# EasyEDA Pro project NU1680无线充电接收端底座.eprj, board 磁吸
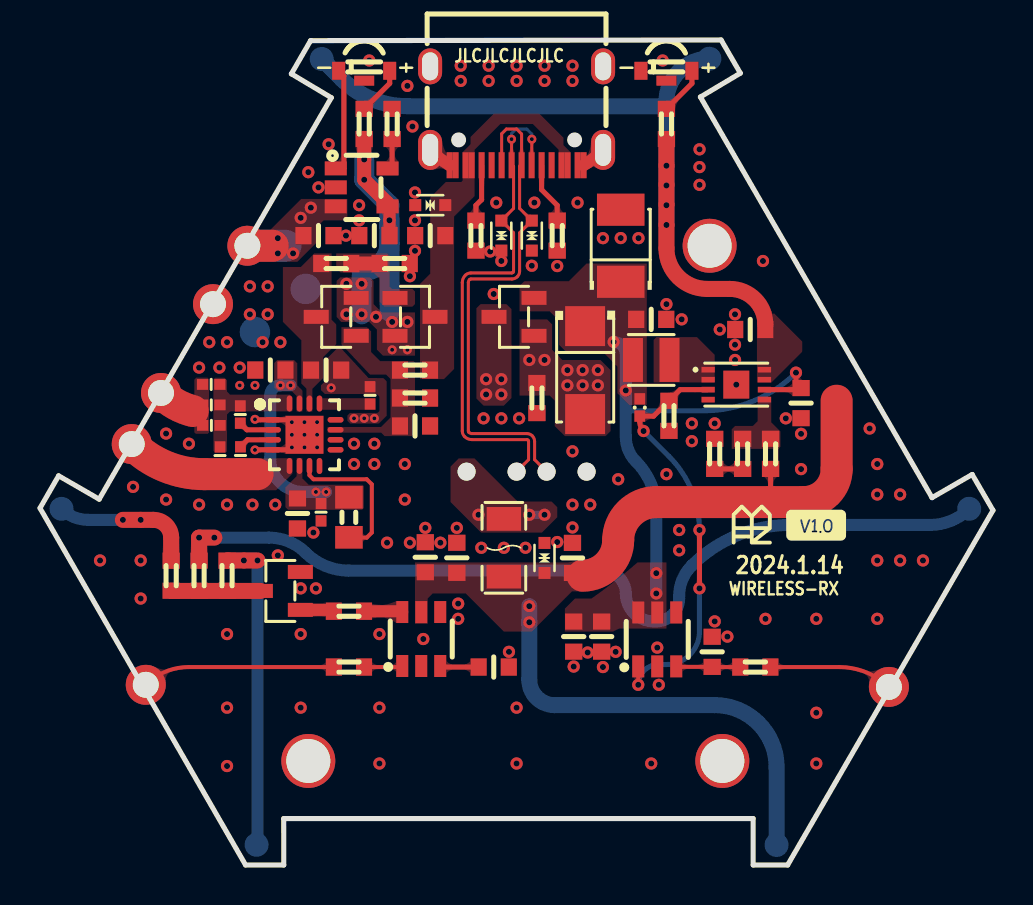
[diagram p2: board, top side]
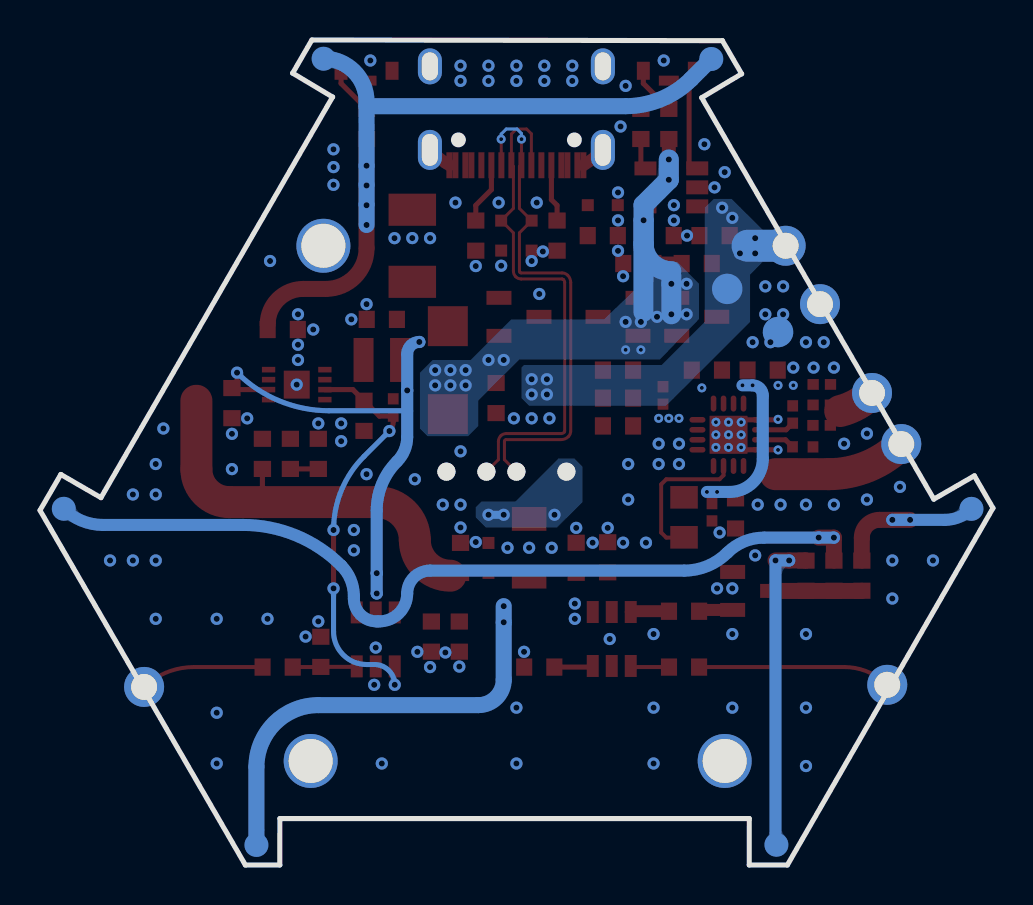
[diagram p3: board, bottom side, seen from below]

Outline 47.65 x 41.29 mm; copper layers: Top Layer, Bottom Layer. Coordinates in mm from the lower left corner of the outline.
Outline path: 0,17.86 10.28,0 12.19,0 12.19,2.33 35.66,2.33 35.66,0 37.38,0 47.65,17.75 46.61,19.54 44.6,18.38 33.02,38.43 35.02,39.63 34.06,41.29 13.53,41.25 12.57,39.59 14.57,38.4 2.96,18.31 0.93,19.48 0,17.86
Stack: Top Layer 0.035mm / Dielectric1 1.51mm FR4 er 4.5 / Bottom Layer 0.035mm

## Design rules (mm)
net USB_DV_D+: DP1
net USB_DV_D-: DP1
template: 自定义配置1
spacing copperThickness1oz (default): track to track 0.102, other pairs 0.152 to 0.3
spacing copperThickness2oz: track to track 0.203, other pairs 0.152 to 0.3
spacing safeClearance: track to track 0.089, other pairs 0.089 to 0.3
spacing Default: track to track 0.099, other pairs 0 to 0.099
track width copperThickness1oz (default): min 0.127, default 0.254, max 2.54
track width copperThickness2oz: min 0.203, default 0.254, max 2.54
track width Default: min 0.14, default 0.14, max 25.4
differential pair differentialPair (default): width min 0.127, default 0.254, max 2.54; gap min 0.152, default 0.152
via viaSize (default): diameter min 0.439, default 0.439, max 100.025; hole min 0.191, default 0.191, max 59.995
via Default: diameter min 0.439, default 0.439, max 100.025; hole min 0.191, default 0.191, max 59.995
region e3966 uses copperRegion1
region e3967 uses copperRegion1
region e7122 uses copperRegion1
region e7123 uses copperRegion1
pour e3968 uses copperRegion

## Placement (name value [footprint] x y rotation side)
C1  47nF/0402/50V  [C0402]  10.02 20.5 270 top
C2  47nF/0402/50V  [C0402]  10.02 22.54 270 top
C3  1uF/0402  [C0402]  16.5 23.5 270 top
C7  100nF/0402/50V  [C0402]  8.57 22 180 top
C8  47nF/0402/50V  [C0402]  8.56 23.03 180 top
C9  33nF/0402/50V  [C0402]  8.56 24.05 180 top
C10  10uF/0603  [C0603]  11.52 24.77 0 top
C11  10uF/0603  [C0603]  12.87 17.59 90 top
C12  100nF/0402/50V  [C0402]  14.05 17.65 270 top
C21  2.2nF/0402/50V  [C0402]  9 20.49 270 top
C22  100nF/0603  [C0603]  18.75 21.97 180 top
C23  4.7uF/0603  [C0603]  16.72 31.5 0 top
C24  10uF/0603  [C0603]  13.92 31.5 180 top
C27  100uF  [CAP-SMD_L3.5-W2.8]  29.04 30.99 270 top
C28  22uF/0603  [C0603]  30.56 27.31 0 top
C29  22uF/0603  [C0603]  35.51 26.8 180 top
C30  1uF/0603  [C0603]  38.05 23.12 90 top
C32  10uF/0603  [C0603]  26.62 15.37 90 top
C33  10uF/0603  [C0603]  20.84 15.37 90 top
C34  10nF/0603  [C0603]  22.69 9.91 0 top
C35  100nF/0603  [C0603]  19.27 15.4 90 top
C36  10uF/0603  [C0603]  14.3 24.77 0 top
C37  10pF/0603  [C0603]  33.61 10.67 90 top
C38  10uF/0603  [C0603]  19.51 31.5 180 top
C39  10uF/0603  [C0603]  28.08 11.43 270 top
C40  100nF/0603  [C0603]  26.69 11.43 270 top
D3  SS34_C3032484  [SMA_L4.3-W2.6-LS5.2-RD]  27.26 24.77 270 top
D9  LESD5D5.0CT1G  [SOD-523_L1.2-W0.8-LS1.6-BI]  24.59 31.5 90 top
D10  LESD5D5.0CT1G  [SOD-523_L1.2-W0.8-LS1.6-BI]  23.07 31.5 90 top
D11  LESD5D5.0CT1G  [SOD-523_L1.2-W0.8-LS1.6-BI]  19.51 33.02 0 top
D12  LESD5D5.0CT1G  [SOD-523_L1.2-W0.8-LS1.6-BI]  25.23 15.37 270 top
H1  2.54-1*1P针  [2mm-1.3mm孔]  6.05 23.62 90 top
H2  2.54-1*1P针  [2mm-1.3mm孔]  4.59 21.07 0 top
H3  2.54-1*1P针  [2mm-1.3mm孔]  5.29 9.02 180 top
H6  2.54-1*1P针  [2mm-1.3mm孔]  42.45 8.91 90 top
H7  2.54-1*1P针  [2mm-1.3mm孔]  10.37 30.99 0 top
H8  2.54-1*1P针  [2mm-1.3mm孔]  8.65 28.07 0 top
L4  1.5uH  [IND-SMD_L2.5-W2.0_MHCD252012A]  30.56 25.27 180 top
LED1  CHARGE  [LED-SMD_L3.2-W1.0-R-RD]  16.21 39.5 0 top
LED2  OUT  [LED-SMD_L3.2-W1.0-R-RD]  31.32 39.5 0 top
NOREF  -  [Pad_e233]  13.42 5.21 0 top
NOREF#2  -  [Pad_e234]  34.12 5.21 0 top
NOREF#3  -  [Pad_e119]  33.48 30.99 0 top
NOREF#4  -  [Pad_e393]  10.75 26.67 0 top
NOREF#5  -  [Pad_e391]  13.29 28.83 0 top
Q2  DMG2305UX-7  [SOT-23-3_L2.9-W1.3-P1.90-LS2.4-BR]  18.75 27.43 180 top
Q3  DMG2305UX-7  [SOT-23-3_L2.9-W1.3-P1.90-LS2.4-BR]  14.81 27.43 0 top
Q8  DMG2305UX-7  [SOT-23-3_L2.9-W1.3-P1.90-LS2.4-BR]  23.7 27.43 0 top
Q10  S8050  [SOT-23-3_L2.9-W1.3-P1.90-LS2.4-BR]  12.02 13.72 0 top
R1  220R/0805  [R0805]  15.45 17.4 90 top
R2  5.1k  [R0603]  18.75 24.77 0 top
R3  100k  [R0603]  18.75 23.37 0 top
R4  5.1k  [R0603]  14.81 30.1 180 top
R5  100k  [R0603]  17.73 30.1 0 top
R7  1k  [R0603]  16.21 37.09 90 top
R27  1M  [R0603]  36.53 20.58 270 top
R28  15.8k  [R0603]  35.13 20.58 90 top
R29  300k  [R0603]  33.74 20.58 270 top
R33  5.1k  [R0603]  21.8 31.5 270 top
R34  5.1k  [R0603]  25.86 31.5 270 top
R35  5.1k  [R0603]  15.45 9.91 0 top
R38  2k  [R0603]  15.45 12.7 180 top
R44  1k  [R0603]  35.77 9.91 0 top
R48  1M  [R0603]  24.85 23.37 270 top
R49  2k  [R0603]  17.61 37.09 270 top
R51  0R/NC  [R0402]  29.99 22.9 270 top
R52  2k  [R0603]  31.32 37.09 270 top
R53  1M  [R0603]  31.45 22.48 90 top
R54  20R  [R0603]  6.56 14.48 90 top
R55  20R  [R0603]  7.95 14.48 90 top
R56  20R  [R0603]  9.35 14.48 90 top
U1  NU1680  [QFN-16_L3.0-W3.0-P0.50-TL-EP1.9]  13.21 21.53 0 top
U4  TP4054  [TSOT-23-5_L2.9-W1.6-P0.95-LS2.8-BR]  16.08 33.91 180 top
U5  SY7088DGC  [DFN-8_L3.0-W2.0-P0.50-BL-EP]  34.82 24.04 270 top
U6  6021WS  [SOT-23-6_L2.9-W1.6-P0.95-LS2.8-BR]  19.06 11.31 270 top
U8  -  [3V 24MM LED S]  39.96 29.08 210 bottom
U9  -  [3V 24MM LED S]  23.83 1.02 90 bottom
U10  -  [3V 24MM LED S]  7.57 29.08 150 bottom
U14  RH6015C  [SOT-23-6_L2.9-W1.6-P0.95-LS2.8-BR]  30.86 11.29 270 top
U15  TLC-NSMD100  [F1206]  23.2 15.88 270 top
U16  -  [螺旋磁吸充电公座4P]  23.83 19.69 0 bottom
USB2  TYPE-C-31-M-12  [USB-C_SMD-TYPE-C-31-M-12]  23.83 37.49 180 top

## Footprints (pads in the part's own frame, mm; a bottom-side part is the same pattern mirrored in y, then rotated)
2mm-1.3mm孔
  round 2 hole 1.3x1.1: 1(0,0)
3V 24MM LED S
  round 1.2 smd: 1(-0.013,13) 2(-0.003,-13)
C0402
  rect 0.566x0.54 smd: 1(-0.433,0) 2(0.433,0)
C0603
  rect 0.806x0.864 smd: 1(-0.753,0) 2(0.753,0)
CAP-SMD_L3.5-W2.8
  rect 1.607x2.376 smd: 1(1.804,0) 2(-1.804,0)
DFN-8_L3.0-W2.0-P0.50-BL-EP
  rect 0.28x0.665 smd: 1(-0.75,-1.407) 2(-0.25,-1.407) 3(0.25,-1.407) 4(0.75,-1.407) 5(0.75,1.407) 6(0.25,1.407) 7(-0.25,1.407) 8(-0.75,1.407)
  rect 1.4x1.3 smd: 9(0,0)
F1206
  rect 1.19x1.728 smd: 1(-1.445,0) 2(1.445,0)
IND-SMD_L2.5-W2.0_MHCD252012A
  rect 1x2.2 smd: 1(0.913,0) 2(-0.913,0)
LED-SMD_L3.2-W1.0-R-RD
  rect 0.65x0.9 smd: 1(1.275,0.247) 2(-1.275,0.247)
  rect 1x0.5 smd: 3(0,-0.247)
Pad_e119
  round 2.7 hole 2.2: 18(0,0)
Pad_e233
  round 2.7 hole 2.2: 18(0,0)
Pad_e234
  round 2.7 hole 2.2: 18(0,0)
Pad_e391
  round 1.524 smd far side: 19(0,0)
Pad_e393
  round 1.524 smd far side: 19(0,0)
QFN-16_L3.0-W3.0-P0.50-TL-EP1.9
  oval 0.8x0.28 smd: 1(-1.565,0.749) 2(-1.565,0.249) 3(-1.565,-0.251) 4(-1.565,-0.751) 9(1.565,-0.751) 10(1.565,-0.251) 11(1.565,0.249) 12(1.565,0.749)
  oval 0.28x0.8 smd: 5(-0.739,-1.562) 6(-0.238,-1.562) 7(0.261,-1.562) 8(0.761,-1.562) 13(0.761,1.562) 14(0.261,1.562) 15(-0.238,1.562) 16(-0.739,1.562)
  rect 1.9x1.9 smd: 17(0.011,-0.001)
R0402
  rect 0.566x0.54 smd: 1(-0.433,0) 2(0.433,0)
R0603
  rect 0.806x0.864 smd: 1(-0.753,0) 2(0.753,0)
R0805
  rect 1.133x1.377 smd: 1(-1,0) 2(1,0)
SMA_L4.3-W2.6-LS5.2-RD
  rect 2x2 smd: 1(-2.2,0) 2(2.2,0)
SOD-523_L1.2-W0.8-LS1.6-BI
  rect 0.6x0.6 smd: 1(-0.75,0) 2(0.75,0)
SOT-23-3_L2.9-W1.3-P1.90-LS2.4-BR
  rect 1.25x0.7 smd: 1(1,-0.95) 2(1,0.95) 3(-1,0)
SOT-23-6_L2.9-W1.6-P0.95-LS2.8-BR
  rect 1.1x0.6 smd: 1(1.35,-0.95) 2(1.35,0) 3(1.35,0.95) 4(-1.35,0.95) 5(-1.35,0) 6(-1.35,-0.95)
TSOT-23-5_L2.9-W1.6-P0.95-LS2.8-BR
  rect 1.1x0.7 smd: 1(1.294,-0.951) 2(1.294,-0.001) 3(1.294,0.951) 4(-1.294,0.951) 5(-1.294,-0.949)
USB-C_SMD-TYPE-C-31-M-12
  oval 1.2x2 hole 0.8x1.6: 0(-4.325,1.706) 1(4.325,1.706)
  oval 1.2x1.8 hole 0.8x1.4: 2(4.325,-2.474) 3(-4.325,-2.474)
  rect 0.3x1.3 smd: A1(-3.35,2.474) A4(-2.55,2.474) A5(-1.25,2.474) A6(-0.25,2.474) A7(0.25,2.474) A8(1.25,2.474) A9(2.55,2.474) A12(3.35,2.474) B1(3.05,2.474) B4(2.25,2.474) B5(1.75,2.474) B6(0.75,2.474) B7(-0.75,2.474) B8(-1.75,2.474) B9(-2.25,2.474) B12(-3.05,2.474)
螺旋磁吸充电公座4P
  round 0.9 hole 0.914x0.65: 1(0,0) 2(1.5,0) 3(-2.5,0) 4(3.5,0)

## Nets
As in the schematic, except:
GND: C3.1 C10.1 C11.1 C12.2 C22.1 C23.1 C24.1 C27.2 C28.2 C29.2 C30.1 C32.2 C33.2 C34.2 C35.2 C36.2 C37.2 C38.2 C39.2 C40.2 D9.1 D10.1 D11.1 D12.1 H8.1 LED2.2 NOREF#4.19 Q10.2 R3.2 R5.2 R29.1 R33.2 R34.2 R48.2 R49.1 R53.1 U1.1 U1.4 U1.17 U4.2 U5.4 U5.9 U6.2 U6.4 U14.2 U16.4 USB2.0 USB2.1 USB2.2 USB2.3 USB2.A1 USB2.A12 USB2.B1 USB2.B12
VBAT: C24.2 H7.1 NOREF#5.19 Q8.3 U4.3

Pads without a net: LED1 3; LED2 3; NOREF 18; NOREF#2 18; NOREF#3 18; U1 8 9 10 12; U14 4; USB2 A8 B8

## Via types
v1: diameter 0.611, hole 0.305, Top Layer to Bottom Layer, 190 vias
v2: diameter 0.45, hole 0.2, Top Layer to Bottom Layer, 25 vias

## Routing (per net, layer and track width the routed paths; a pad name or vN(x,y) marks a point on that pad's centre or on a via; arc(x,y) is an arc through that point)
GND: length 8.1
  Top Layer w0.254: v2(10.75,20.77) 10.76,20.78 U1.4 12.47,20.78 v2(13.22,21.53) 12.47,22.28 U1.1 10.77,22.28 v2(10.75,22.3)
  Top Layer w0.6: USB2.1 arc(19.97,35.37) USB2.A12 ; USB2.A1 arc(27.29,35.08) 27.39,35.15 arc(27.79,35.45) USB2.0
  vias: v1(3,15.24) v1(4.65,18.92) v1(5.03,15.24) v1(5.03,13.34) v1(6.3,21.59) v1(6.3,18.29) v1(7.45,21.08) v1(7.95,24.89) v1(7.95,18.04) v1(8.46,26.16) v1(8.97,24.89) v1(9.35,26.16) v1(9.35,18.04) v1(9.35,11.56) v1(9.35,7.88) v1(9.35,4.95) v1(9.99,24.89) v1(10.49,28.96) v1(10.49,27.56) v1(10.62,18.04) v1(11.13,26.16) v1(11.38,28.96) v1(11.38,27.56) v1(11.77,18.04) v1(11.89,15.5) v1(12.02,26.16) v1(13.04,13.84) v1(13.04,11.56) v1(13.04,7.88) v1(13.42,34.67) v1(13.67,16.64) v1(13.8,13.84) v1(13.92,33.91) v1(14.43,36.07) v1(15.3,31.5) v1(15.7,21.08) v1(15.7,20.07) v1(15.96,33.02) v1(15.96,32.26) v1(16.46,40.26) v1(16.72,21.08) v1(16.72,20.07) v1(16.97,11.56) v1(16.97,7.88) v1(16.97,5.08) v1(17.35,16.13) v1(18.24,20.07) v1(18.24,18.29) v1(18.37,38.99) v1(18.5,29.47) v1(18.5,16.13) v1(18.62,36.96) v1(18.75,33.66) v1(18.75,32.26) v1(18.75,30.74) v1(19.16,11.31) v1(19.27,16.87) v1(20.02,16.13) v1(20.84,16.87) v1(20.91,13.08) v1(20.91,12.32) v1(21.04,40) v1(21.04,39.24) v1(22.07,15.88) v1(22.18,22.35) v1(22.43,40) v1(22.43,39.24) v1(22.51,30.7) v1(22.69,28.58) v1(22.81,33.15) v1(23.07,30.23) v1(23.07,22.35) v1(23.2,15.88) v1(23.45,10.67) v1(23.83,40) v1(23.83,39.24) v1(23.83,7.88) v1(23.83,5.08) v1(23.96,22.35) v1(24.27,15.88) v1(24.59,29.99) v1(24.72,33.15) v1(25.23,40) v1(25.23,39.24) v1(25.86,29.97) v1(25.86,16.16) v1(26.62,40) v1(26.62,39.24) v1(26.62,20.7) v1(26.62,18.04) v1(26.62,16.89) v1(26.69,9.93) v1(26.88,33.15) v1(27.38,10.64) v1(27.51,18.04) v1(28.15,31.37) v1(28.15,9.91) v1(28.78,10.67) v1(28.91,19.31) v1(29.04,31.37) v1(29.93,31.37) v1(30.56,5.08) v1(30.86,10.88) v1(30.94,9.02) v1(31.14,40.26) v1(31.32,28.07) v1(31.32,19.56) v1(31.96,16.77) v1(31.96,15.75) v1(32.08,27.31) v1(32.59,22.1) v1(32.59,21.21) v1(32.98,35.82) v1(32.97,34.93) v1(32.98,34.04) v1(33.74,22.1) v1(33.74,12.19) v1(33.99,26.8) v1(34.37,11.43) v1(34.75,27.56) v1(34.75,26.04) v1(34.75,25.27) v1(34.82,24.04) v1(36.15,30.23) v1(36.28,12.32) v1(37.29,22.35) v1(38.05,21.58) v1(38.05,19.81) v1(38.82,12.32) v1(38.82,7.62) v1(38.82,5.08) v1(41.48,21.85) v1(41.86,20.07) v1(41.86,18.54) v1(41.86,15.24) v1(41.86,12.32) v1(43.01,18.54) v1(43.01,15.24) v1(44.15,15.24) v2(9.99,24) v2(10.75,24) v2(12.59,22.16) v2(12.59,21.53) v2(12.59,20.9) v2(13.22,22.16) v2(13.23,20.9) v2(13.85,22.16) v2(13.86,21.53) v2(13.86,20.9) v2(14.56,23.88) v2(15.7,22.35) v2(16.21,22.35) v2(16.72,22.35)
VBAT: length 3.2
  Top Layer w1.6: H7.1 11.64,30.99
  Bottom Layer w1.6: H7.1 12.27,30.99
  vias: v1(11.89,31.37) v1(11.89,30.61) v1(12.65,30.61) v1(13.04,32.39) v1(13.54,32.89) v1(22.31,24.31) v1(22.31,23.55) v1(23.07,24.31) v1(23.07,23.55)
VIN: length 19
  Top Layer w0.6: 17.38,32.96 17.47,32.87 v1(17.47,32.26) C23.2
  Top Layer w0.7: R7.1 v1(16.21,35.31) v1(16.21,34.29) 17.38,33.12 17.38,32.96
  Bottom Layer w1: 16.08,29.46 v1(16.08,29.08) v1(16.08,27.56) ; 17.47,31.11 17.47,30.85 ; 17.47,31.11 v1(17.47,32.26) ; 17.47,31.11 arc(17.06,30.13) 16.08,29.72 ; v1(16.21,35.31) v1(16.21,34.29) 17.47,33.03 v1(17.47,32.26) ; v1(17.47,32.26) 17.48,27.69
  vias: v1(15.32,29.08) v1(15.32,27.56) v1(16.8,27.43) v1(17.61,27.18) v1(18.37,27.18) v1(24.46,25.27) v1(25.23,25.27) v1(26.37,24.77) v1(26.37,24) v1(27.13,24.77) v1(27.13,24) v1(27.89,24.77) v1(27.89,24) v2(17.61,25.78) v2(18.37,25.78)
C1_CC1: length 3.1
  Top Layer w0.254: R34.1 25.86,33.01 25.08,33.79 USB2.A5
C1_CC2: length 2.9
  Top Layer w0.254: R33.1 21.8,33.01 22.08,33.3 USB2.B5
USB_DV_D+: length 25.8
  Top Layer w0.15: 23.08,35.09 23.08,36.59 23.32,36.83 23.83,36.83 24.08,36.58 24.08,35.09 ; USB2.A6 24.03,35.02 23.98,34.97 23.98,32.86 D9.2 23.98,31.64 23.98,29.72 arc(23.95,29.57) 23.87,29.44 arc(23.74,29.36) 23.59,29.33 21.54,29.33 arc(21.51,29.32) 21.48,29.3 arc(21.43,29.23) 21.42,29.15 21.42,21.72 arc(21.42,21.68) 21.44,21.65 arc(21.51,21.61) 21.6,21.59 24.34,21.59 arc(24.49,21.56) 24.62,21.48 arc(24.7,21.35) 24.73,21.2 24.73,20.29 U16.2
USB_DV_D-: length 25.8
  Top Layer w0.15: USB2.A7 23.63,35.02 23.68,34.97 23.68,32.86 D10.2 23.68,31.64 23.68,29.72 arc(23.67,29.68) 23.65,29.66 arc(23.62,29.64) 23.59,29.63 21.54,29.63 arc(21.39,29.6) 21.27,29.51 arc(21.15,29.35) 21.11,29.15 21.11,21.72 arc(21.14,21.57) 21.23,21.44 arc(21.4,21.33) 21.6,21.29 24.34,21.29 arc(24.37,21.28) 24.4,21.26 arc(24.42,21.23) 24.43,21.2 ; 24.43,21.2 24.43,20.29 U16.1 ; v2(24.59,36.32) 24.58,35.09 ; v2(23.58,36.32) 23.58,35.09
  Bottom Layer w0.15: v2(23.58,36.32) 23.58,36.61 23.8,36.83 24.34,36.83 24.59,36.58 v2(24.59,36.32)
VOUT: length 83.7
  Top Layer w0.254: R27.2 36.53,17.91 ; 39.82,19.82 arc(39.83,19.82) 39.83,19.81
  Top Layer w0.8: R52.2 v1(31.32,35) v1(31.32,32.03) 31.32,30.86 arc(31.92,29.43) 33.36,28.83 34.49,28.83 arc(35.75,28.31) 36.27,27.05
  Top Layer w1.6: 39.83,23.23 39.83,19.81 arc(39.35,18.64) 38.19,18.16 30.82,18.16 arc(29.47,17.6) 28.91,16.26 arc(28.39,15) 27.13,14.48
  Bottom Layer w0.8: v1(24.46,12.96) v1(24.46,12.15) 24.46,9.27 arc(24.84,8.37) 25.73,8 33.74,8 arc(35.92,7.1) 36.83,4.91 U9.1 ; 31.32,37.97 18.37,37.97 arc(16.59,38.33) 15.09,39.33 U10.1 ; 31.32,37.97 31.32,38.2 arc(31.95,39.72) U8.1 ; 31.32,37.97 v1(31.32,35) v1(31.32,32.03)
  vias: v1(31.32,34.01) v1(31.32,33.02)
VRECT: length 8.2
  Bottom Layer w0.6: v2(12.53,24) v2(12.02,24) arc(11.66,23.86) 11.51,23.5 11.51,20.33 arc(12,19.15) 13.17,18.67 v2(13.8,18.67) v2(14.3,18.67)
$1N670: length 1.8
  Top Layer w0.254: U1.2 10.35,21.78 C2.2
$1N673: length 1.8
  Top Layer w0.254: U1.3 10.38,21.28 C1.1
$1N722: length 1.9
  Top Layer w1.6: H1.1 6.06,23.62 arc(6.79,23.06) 7.64,22.72
$1N847: length 6.7
  Top Layer w1.6: 10.88,19.56 8.23,19.56 arc(6.26,19.95) H2.1
$1N1319: length 7.4
  Top Layer w0.2: U1.7 13.47,19.5 13.67,19.31 16.34,19.31 16.59,19.05 16.59,16.64 16.34,16.38 15.46,16.38 R1.1
$1N1795: length 1.4
  Top Layer w0.7: R4.1 R5.1
$1N2387: length 1.6
  Top Layer w0.254: U4.5 17.61,35.09 R49.2
$1N2482: length 2.4
  Top Layer w0.254: R7.2 17.48,39.11 LED1.1
$1N2485: length 5.4
  Top Layer w0.254: 14.79,34.86 15.19,34.86 15.19,39.49 LED1.2
$1N2915: length 1.4
  Top Layer w0.254: R29.2 R28.1
$1N6971: length 1.9
  Top Layer w0.2: R35.2 17.98,9.91 arc(18.05,9.92) U6.1
$1N6996: length 1.9
  Top Layer w0.254: C34.1 20.14,9.91 arc(20.07,9.92) U6.3
$1N8291: length 9.7
  Top Layer w0.2: 5.46,9.18 5.49,9.13 ; 5.46,9.18 5.45,9.19 ; 5.46,9.18 arc(5.37,9.1) H3.1 ; 5.46,9.18 arc(6.38,9.72) 7.43,9.91 R35.1
$1N8729: length 1.9
  Top Layer w0.6: R38.1 18.02,12.7 arc(18.07,12.69) U6.6
$1N8745: length 1.7
  Top Layer w0.6: Q10.1 14.54,12.77 arc(14.62,12.75) R38.2
$1N12385: length 6
  Top Layer w0.2: 42.2,9.13 42.2,9.13 ; 42.2,9.13 42.21,9.15 ; 42.2,9.13 arc(42.19,9.14) 42.18,9.15 42.18,9.14 ; 42.2,9.13 42.17,9.07 ; 42.2,9.13 arc(42.19,9.13) 42.18,9.14 ; 42.18,9.14 42.15,9.09 ; 42.18,9.14 arc(41.13,9.71) 39.96,9.91 R44.2
$1N12389: length 3.2
  Top Layer w0.2: R44.1 33.63,9.91 arc(33.62,9.91) C37.1 31.87,9.92 arc(31.84,9.92) U14.3
$1N13075: length 4.5
  Top Layer w0.8: Q10.3 6.58,13.72 arc(6.57,13.72) R54.1
$1N13108: length 21.2
  Top Layer w0.2: U14.1 v1(29.91,9.02)
  Top Layer w0.254: v1(32.97,16.77) v1(32.97,13.84) ; U5.3 32.01,23.79 R53.2 30.68,22.46 R51.2 29.99,22.18 arc(30.04,21.93) v1(30.18,21.72)
  Bottom Layer w0.254: v1(32.97,13.84) 32.97,11.69 arc(32.49,10.52) 31.32,10.03 30.93,10.03 arc(30.21,9.74) v1(29.91,9.02) ; v1(30.18,21.72) 31.45,20.45 arc(32.58,18.76) v1(32.97,16.77)
$1N13189: length 2.4
  Top Layer w0.254: LED2.1 32.6,39.11 R52.1
$1N13550: length 8.2
  Top Layer w0.8: v1(4.14,17.27) v1(5.03,17.27) 5.67,17.27 arc(6.3,17.01) 6.56,16.38 R54.2
  Bottom Layer w0.6: v1(5.03,17.27) v1(4.14,17.27) 2.41,17.27 arc(1.69,17.42) 1.08,17.82
$1N13622: length 44.9
  Top Layer w0.8: v1(8.72,16.38) v1(7.95,16.38) R55.2
  Bottom Layer w0.6: v1(7.95,16.38) v1(8.72,16.38) 11.45,16.38 arc(12.45,16.19) 13.29,15.62 arc(14.27,14.96) 15.43,14.73 28.15,14.73 arc(28.96,14.4) 29.29,13.59 arc(29.7,12.6) 30.69,12.19 30.82,12.19 arc(31.62,12.53) 31.96,13.34 31.96,13.46 arc(32.12,14.28) 32.59,14.98 32.59,14.99 arc(34.84,16.49) 37.5,17.02 44.51,17.02 arc(45.57,17.23) U8.2
$1N13646: length 16.4
  Top Layer w0.8: v1(10.88,15.24) v1(10.19,15.24) 9.37,15.24 arc(9.36,15.24) R56.2
  Bottom Layer w0.6: v1(10.19,15.24) v1(10.88,15.24) 10.88,1.12 arc(10.86,1.06) U9.2
$1N20771: length 0.8
  Bottom Layer w0.4: v1(25.23,17.53) v1(24.46,17.53)
  vias: v1(21.92,17.53)
$1N27060: length 25.1
  Top Layer w0.254: v1(37.8,24.64) 37.8,24.12 C30.2 arc(38.03,23.81) 37.98,23.79 U5.6
  Bottom Layer w0.254: 29.29,22.73 33.2,22.73 arc(35.69,23.23) v1(37.8,24.64)
  Bottom Layer w0.6: v1(30.82,13.59) v1(30.82,14.61) 30.82,17.74 arc(30.55,19.07) 29.8,20.19 arc(29.42,20.76) 29.29,21.42 v1(29.29,23.75) 29.29,25.57 arc(29.11,26) v1(28.68,26.18)

## Copper pours and planes (outline as drawn; the poured copper is in the pictures)
GND on Top Layer: 14.05,25.82 17.34,25.82 17.34,22.09 14.05,22.09
GND on Top Layer: -5.76,48.64 52.28,48.64 54.31,46.61 54.31,4.07 45.04,-5.21 -4.75,-5.21 -5.76,-4.19
GND on Bottom Layer: -4.62,48.13 53.42,48.13 55.45,46.1 55.45,3.56 46.18,-5.71 -3.6,-5.71 -4.62,-4.7
VBAT on Top Layer: 11.51,33.33 15.37,33.33 15.37,30.19 11.51,30.19
VBAT on Top Layer: 21.82,28.07 23.58,28.07 23.58,22.99 21.82,22.99
VBAT on Bottom Layer: 11.51,33.33 23.58,33.33 23.58,22.99 11.51,22.99
VIN on Top Layer: 23.97,27.31 28.53,27.31 28.53,21.46 23.97,21.46
VIN on Top Layer: 14.83,29.41 18.75,29.41 18.75,25.49 14.83,25.49
VIN on Bottom Layer: 14.7,30.18 28.66,30.18 28.66,21.46 14.7,21.46
VIN1 on Top Layer: 19,35.67 21.73,35.67 21.73,24.32 19,24.32
VIN1 on Top Layer: 21.13,37.59 26.53,37.59 26.53,34.37 21.13,34.37
VIN2 on Top Layer: 12.15,30.61 14.81,30.61 14.81,22.69 12.15,22.69
VOUT on Top Layer: 35.89,23.45 38.59,23.45 39.07,22.93 39.07,19.56 40.63,19.92 40.63,25.65 39.36,27.94 36.29,27.94 35.89,27.54
VOUT on Top Layer: 35.85,27.6 38.11,27.6 38.11,24.14 35.85,24.14
VOUT on Top Layer: 18.75,15.28 27.51,15.28 27.51,11.69 18.75,11.69
VRECT on Top Layer: 12.27,20.37 16.2,20.37 16.2,17.78 12.27,17.78
VRECT on Top Layer: 11.71,25.27 13.12,25.27 13.12,22.7 11.71,22.7
$1N722 on Top Layer: 7.71,24.39 8.45,24.39 8.45,21.58 7.71,21.58
$1N847 on Top Layer: 7.79,20.35 12.62,20.35 12.62,18.75 7.79,18.75
$1N854 on Top Layer: 8.67,24.39 12.62,24.39 12.62,20.63 8.67,20.63
$1N972 on Top Layer: 13.85,23.36 16.77,23.36 16.77,22.78 13.85,22.78
$1N1795 on Top Layer: 14.81,30.61 18.75,30.61 18.75,27.94 14.81,27.94
$1N2905 on Top Layer: 30.68,26.42 33.74,26.42 33.74,24.15 30.68,24.15
$1N2909 on Top Layer: 34.59,23.44 37.03,23.44 37.03,20.83 34.59,20.83
$1N9112 on Top Layer: 14.38,26.91 18.75,26.91 18.75,21.46 14.38,21.46
$1N20771 on Top Layer: 20.53,20.35 25.86,20.35 25.86,16.64 20.53,16.64
$1N20771 on Bottom Layer: 20.53,20.35 25.86,20.35 25.86,16.89 20.53,16.89
$1N27060 on Top Layer: 26.24,15.14 31.32,15.14 31.32,11.69 26.24,11.69
$1N27060 on Top Layer: 23.97,30.1 30.34,30.1 30.34,23.02 23.97,23.02

Small or netless copper shapes (teardrops, artwork), in the pictures only: 86 on Top Layer, 18 on Bottom Layer

## Text on the board
Document Layer: 客编
Top Silkscreen Layer: JLCJLCJLCJLC | WIRELESS-RX | 2024.1.14
